# EAGLE design links_v40 (EAGLE 7.7.0)
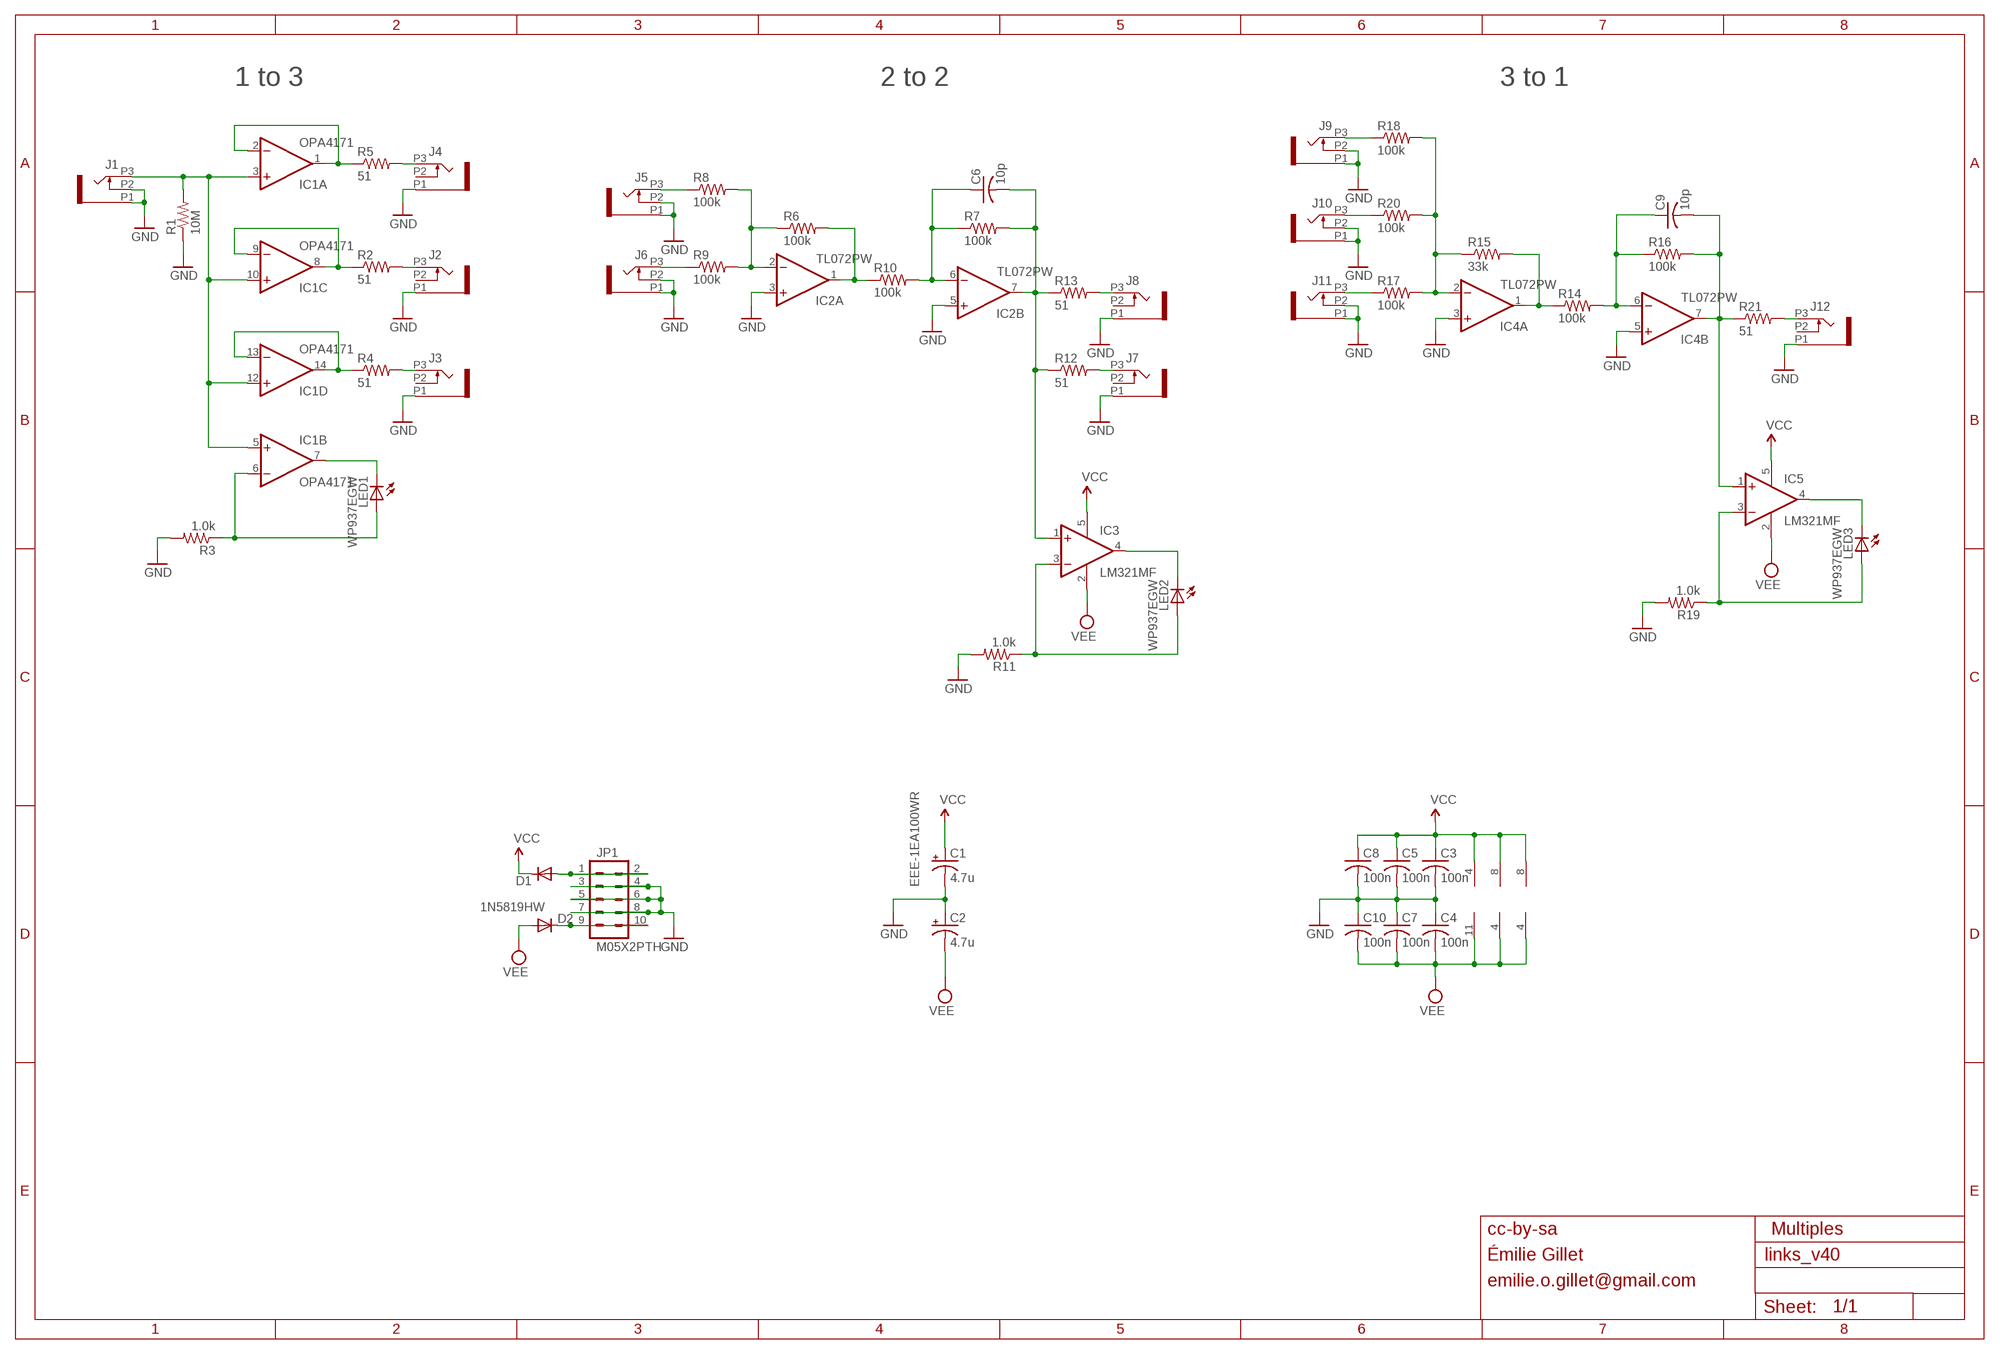
[diagram p0: schematic, sheet 1]

## Parts
C1  4.7u  CPOL-USA  [PANASONIC_A]
C2  4.7u  CPOL-USA  [PANASONIC_A]
C3  100n  C-USC0603  [C0603]
C4  100n  C-USC0603  [C0603]
C5  100n  C-USC0603  [C0603]
C6  10p  C-USC0603  [C0603]
C7  100n  C-USC0603  [C0603]
C8  100n  C-USC0603  [C0603]
C9  10p  C-USC0603  [C0603]
C10  100n  C-USC0603  [C0603]
D1  1N5819HW  DIODE-SOD123  [SOD123]
D2  1N5819HW  DIODE-SOD123  [SOD123]
IC1  OPA4171  TL074PW  [TSSOP14]
IC2  TL072PW  [TSSOP8]
IC3  LM321MF  [SOT23-5]
IC4  TL072PW  [TSSOP8]
IC5  LM321MF  [SOT23-5]
J1  PJ301_THONKICONN6  [WQP_PJ_301M6]
J2  PJ301_THONKICONN6  [WQP_PJ_301M6]
J3  PJ301_THONKICONN6  [WQP_PJ_301M6]
J4  PJ301_THONKICONN6  [WQP_PJ_301M6]
J5  PJ301_THONKICONN6  [WQP_PJ_301M6]
J6  PJ301_THONKICONN6  [WQP_PJ_301M6]
J7  PJ301_THONKICONN6  [WQP_PJ_301M6]
J8  PJ301_THONKICONN6  [WQP_PJ_301M6]
J9  PJ301_THONKICONN6  [WQP_PJ_301M6]
J10  PJ301_THONKICONN6  [WQP_PJ_301M6]
J11  PJ301_THONKICONN6  [WQP_PJ_301M6]
J12  PJ301_THONKICONN6  [WQP_PJ_301M6]
JP1  M05X2PTH  [AVR_ICSP]
LED1  WP937EGW  LED3MM  [LED3MM]
LED2  WP937EGW  LED3MM  [LED3MM]
LED3  WP937EGW  LED3MM  [LED3MM]
R1  10M  R-US_R0603  [R0603]
R2  51  R-US_R0603  [R0603]
R3  1.0k  R-US_R0603  [R0603]
R4  51  R-US_R0603  [R0603]
R5  51  R-US_R0603  [R0603]
R6  100k  R-US_R0603  [R0603]
R7  100k  R-US_R0603  [R0603]
R8  100k  R-US_R0603  [R0603]
R9  100k  R-US_R0603  [R0603]
R10  100k  R-US_R0603  [R0603]
R11  1.0k  R-US_R0603  [R0603]
R12  51  R-US_R0603  [R0603]
R13  51  R-US_R0603  [R0603]
R14  100k  R-US_R0603  [R0603]
R15  33k  R-US_R0603  [R0603]
R16  100k  R-US_R0603  [R0603]
R17  100k  R-US_R0603  [R0603]
R18  100k  R-US_R0603  [R0603]
R19  1.0k  R-US_R0603  [R0603]
R20  100k  R-US_R0603  [R0603]
R21  51  R-US_R0603  [R0603]

## Nets
GND: C1.- C2.+ C3.2 C4.1 C5.2 C7.1 C8.2 C10.1 IC2.3(A:+IN) IC2.5(B:+IN) IC4.3(A:+IN) IC4.5(B:+IN) J1.P1 J1.P2 J2.P1 J3.P1 J4.P1 J5.P1 J5.P2 J6.P1 J6.P2 J7.P1 J8.P1 J9.P1 J9.P2 J10.P1 J10.P2 J11.P1 J11.P2 J12.P1 JP1.3 JP1.4 JP1.5 JP1.6 JP1.7 JP1.8 R1.1 R3.2 R11.2 R19.2
N$1: IC2.1(A:OUT) R6.2 R10.1
N$2: J11.P3 R17.1
N$3: IC1.1(A:OUT) IC1.2(A:-IN) R5.1
N$4: IC1.8(C:OUT) IC1.9(C:-IN) R2.1
N$5: IC1.13(D:-IN) IC1.14(D:OUT) R4.1
N$6: D1.A JP1.1 JP1.2
N$7: IC1.3(A:+IN) IC1.5(B:+IN) IC1.10(C:+IN) IC1.12(D:+IN) J1.P3 R1.2
N$8: IC1.7(B:OUT) LED1.K(C)
N$9: J10.P3 R20.1
N$10: J6.P3 R9.1
N$11: J4.P3 R5.2
N$12: J2.P3 R2.2
N$13: J3.P3 R4.2
N$14: IC3.4(OUT) LED2.K(C)
N$15: J5.P3 R8.1
N$16: J7.P3 R12.2
N$17: J8.P3 R13.2
N$18: C9.2 IC4.7(B:OUT) IC5.1(+IN) R16.2 R21.1
N$19: IC5.3(-IN) LED3.A R19.1
N$20: D2.C JP1.9 JP1.10
N$21: IC1.6(B:-IN) LED1.A R3.1
N$22: J9.P3 R18.1
N$23: J12.P3 R21.2
N$24: IC4.2(A:-IN) R15.1 R17.2 R18.2 R20.2
N$25: IC4.1(A:OUT) R14.1 R15.2
N$26: C6.2 IC2.7(B:OUT) IC3.1(+IN) R7.2 R12.1 R13.1
N$27: C9.1 IC4.6(B:-IN) R14.2 R16.1
N$29: IC3.3(-IN) LED2.A R11.1
N$30: IC5.4(OUT) LED3.K(C)
N$31: IC2.2(A:-IN) R6.1 R8.2 R9.2
N$32: C6.1 IC2.6(B:-IN) R7.1 R10.2
VCC: C1.+ C3.1 C5.1 C8.1 D1.C IC1.4(P:V+) IC2.8(P:V+) IC3.5(V+) IC4.8(P:V+) IC5.5(V+)
VEE: C2.- C4.2 C7.2 C10.2 D2.A IC1.11(P:V-) IC2.4(P:V-) IC3.2(V-) IC4.4(P:V-) IC5.2(V-)
Unconnected: J2.P2 J3.P2 J4.P2 J7.P2 J8.P2 J12.P2

## Notes on the sheet
- 1 to 3 | 2 to 2 | 3 to 1
- EEE-1EA100WR
- cc-by-sa | Multiples
- Émilie Gillet
- emilie.o.gillet@gmail.com

## Library data of the parts
C1 C2 = rcl:CPOL-US: POLARIZED CAPACITOR, American symbol
C3-C10 = rcl:C-US: CAPACITOR, American symbol
D1 D2 = diode:DIODE-: DIODE
IC1 = linear:TL074: OP AMP
IC2 IC4 = linear:TL072: OP AMP
IC3 IC5 = linear:LM321?*: Low Power Single Op Amp Source: http://cache.national.com/ds/LM/LM321.pdf
J1-J12 = og-pj301:PJ301_THONKICONN
JP1 = og-header:M05X2: Header 5x2 Standard 10-pin dual row 0.1" header. Commonly used with AVR-ISP. Use with Spark Fun Electronics SKU: PRT-00778
LED1-LED3 = led:LED: LED OSRAM: - CHIPLED LG R971, LG N971, LY N971, LG Q971, LY Q971, LO R971, LY R971 LH N974, LH R974 LS Q976, LO Q976, LY Q976 LO Q996 - Hyper CHIPLED LW Q18S LB Q993, LB Q99A, LB R99A - SideLED LS A670, LO A670, LY A670, LG A670, LP A670 LB A673, LV A673, LT A673, LW A673 LH A674 LY A675 LS A676, LA A676, LO A676, LY A676, LW A676 LS A679, LY A679, LG A679 - Hyper Micro SIDELED® LS Y876, LA Y876, LO Y876, LY Y876 LT Y87S - SmartLED LW L88C, LW L88S LB L89C, LB L89S, LG L890 LS L89K, LO L89K, LY L89K LS L896, LA L896, LO L896, LY L896 - TOPLED LS T670, LO T670, LY T670, LG T670, LP T670 LSG T670, LSP T670, LSY T670, LOP T670, LYG T670 LG T671, LOG T671, LSG T671 LB T673, LV T673, LT T673, LW T673 LH T674 LS T676, LA T676, LO T676, LY T676, LB T676, LH T676, LSB T676, LW T676 LB T67C, LV T67C, LT T67C, LS T67K, LO T67K, LY T67K, LW E67C LS E67B, LA E67B, LO E67B, LY E67B, LB E67C, LV E67C, LT E67C LW T67C LS T679, LY T679, LG T679 LS T770, LO T770, LY T770, LG T770, LP T770 LB T773, LV T773, LT T773, LW T773 LH T774 LS E675, LA E675, LY E675, LS T675 LS T776, LA T776, LO T776, LY T776, LB T776 LHGB T686 LT T68C, LB T68C - Hyper Mini TOPLED® LB M676 - Mini TOPLED Santana® LG M470 LS M47K, LO M47K, LY M47K Source: http://www.osram.convergy.de LUXEON: - LUMILED® LXK2-PW12-R00, LXK2-PW12-S00, LXK2-PW14-U00, LXK2-PW14-V00 LXK2-PM12-R00, LXK2-PM12-S00, LXK2-PM14-U00 LXK2-PE12-Q00, LXK2-PE12-R00, LXK2-PE12-S00, LXK2-PE14-T00, LXK2-PE14-U00 LXK2-PB12-K00, LXK2-PB12-L00, LXK2-PB12-M00, LXK2-PB14-N00, LXK2-PB14-P00, LXK2-PB14-Q00 LXK2-PR12-L00, LXK2-PR12-M00, LXK2-PR14-Q00, LXK2-PR14-R00 LXK2-PD12-Q00, LXK2-PD12-R00, LXK2-PD12-S00 LXK2-PH12-R00, LXK2-PH12-S00 LXK2-PL12-P00, LXK2-PL12-Q00, LXK2-PL12-R00 Source: www.luxeon.com KINGBRIGHT: KA-3528ASYC Source: www.kingbright.com
R1-R21 = rcl:R-US_: RESISTOR, American symbol

## Board
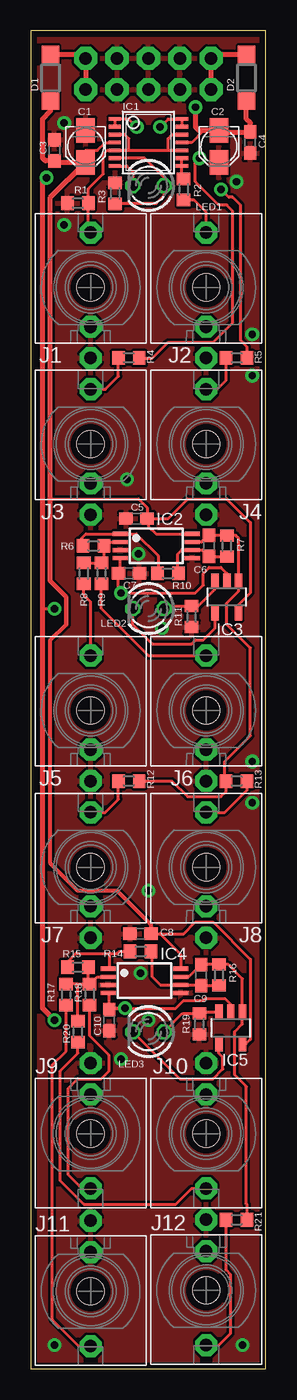
[diagram p1: board, top side]
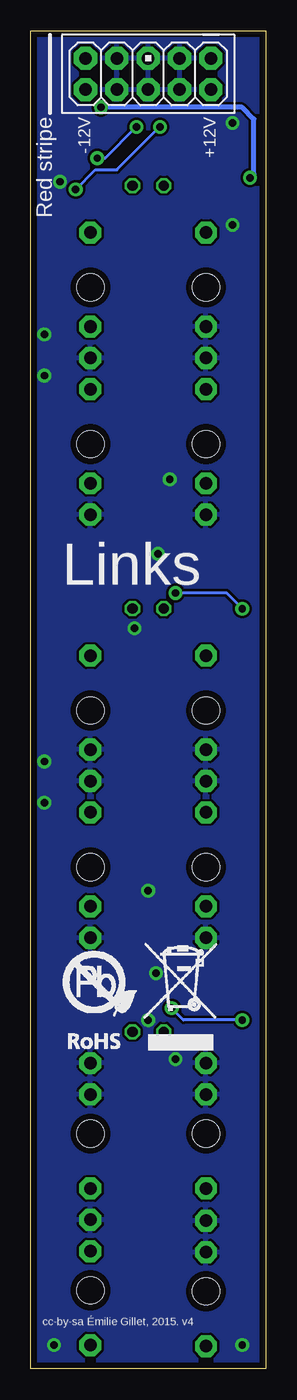
[diagram p2: board, bottom side, seen from below]

Size 19.03 x 108.43 mm. Coordinates in mm from the lower left corner, seen from the top.
Outline: 0,0 19.03,0 19.03,108.43 0,108.43 0,0
Copper layers (1*16): Top 0.035mm / dielectric 1.5mm / Bottom 0.035mm
Design rules "PCBCart-Standard *": minimum track width 8mil, minimum drill 0.4mm, track to track 8mil, track to pad 8mil, pad to pad 8mil, via to via 8mil, smd to smd 8mil, copper to edge 20mil, drill to drill 8mil, minimum pad ring 8mil, minimum via ring 10mil, stop-mask expansion 3mil, vias tented up to drill 25mil, thermal gap 8mil

### Footprints (pad centres in the part's own frame; a part is rotated, then mirrored left to right if it is on the bottom)
PANASONIC_A = smd 2 x 1.5: + 1.3,0; - -1.3,0
C0603 = smd 1.1 x 1: 1 -0.85,0; 2 0.85,0
SOD123 = smd 1.4 x 1.4: A 1.9,0; C -1.9,0
TSSOP14 = smd 0.305 x 0.991: 1 -1.905,-2.718; 2 -1.27,-2.718; 3 -0.635,-2.718; 4 0,-2.718; 5 0.635,-2.718; 6 1.27,-2.718; 7 1.905,-2.718; 8 1.905,2.718; 9 1.27,2.718; 10 0.635,2.718; 11 0,2.718; 12 -0.635,2.718; 13 -1.27,2.718; 14 -1.905,2.718
TSSOP8 = smd 0.35 x 1.2: 1 -0.975,-2.925; 2 -0.325,-2.925; 3 0.325,-2.925; 4 0.975,-2.925; 5 0.975,2.925; 6 0.325,2.925; 7 -0.325,2.925; 8 -0.975,2.925
SOT23-5 = smd 0.6 x 1.2: 1 -0.95,-1.306; 2 0,-1.306; 3 0.95,-1.306; 4 0.95,1.306; 5 -0.95,1.306
WQP_PJ_301M6 = drill 1.016 pad 1.778 octagon: P1 0,-5.715; P2 0,-3.175; P3 0,4.445 | hole 2.2: 0,0
AVR_ICSP = drill 1.016 pad 1.88 octagon: 1 -1.27,5.08; 2 1.27,5.08; 3 -1.27,2.54; 4 1.27,2.54; 5 -1.27,0; 6 1.27,0; 7 -1.27,-2.54; 8 1.27,-2.54; 9 -1.27,-5.08; 10 1.27,-5.08
LED3MM = drill 0.813 octagon: A -1.27,0; K 1.27,0
R0603 = smd 1 x 1.1: 1 -0.85,0; 2 0.85,0

### Placement (x,y rotation side)
C1  4.45,99.06 270 top
C2  15.24,99.06 270 top
C3  1.91,98.74 90 top
C4  17.78,99.38 90 top
C5  8.57,68.9 180 top
C6  14.45,66.67 90 top
C7  7.94,64.45 180 top
C8  8.89,35.24 180 top
C9  13.81,31.91 90 top
C10  6.35,28.26 90 top
D1  1.59,104.62 90 top
D2  17.46,104.62 270 top
IC1  9.53,99.38 270 top
IC2  10.16,66.67 270 top
IC3  15.88,62.55 180 top
IC4  9.21,31.43 270 top
IC5  16.19,27.62 180 top
J1  4.84,87.63 0 top
J2  14.21,87.63 0 top
J3  4.84,74.93 0 top
J4  14.21,74.93 0 top
J5  4.84,53.34 0 top
J6  14.21,53.34 0 top
J7  4.84,40.64 0 top
J8  14.21,40.64 0 top
J9  4.84,19.05 180 top
J10  14.21,19.05 180 top
J11  4.84,6.27 180 top
J12  14.21,6.35 180 top
JP1  9.53,104.93 270 bottom
LED1  9.53,95.89 180 top
LED2  9.53,61.59 180 top
LED3  9.53,27.3 180 top
R1  3.81,94.46 0 top
R2  12.38,95.57 270 top
R3  6.83,95.25 90 top
R4  7.94,81.92 180 top
R5  16.67,81.92 180 top
R6  5.08,66.67 180 top
R7  15.88,66.67 90 top
R8  4.29,64.45 90 top
R9  5.71,64.45 90 top
R10  11.11,64.45 0 top
R11  13.02,60.96 270 top
R12  7.94,47.62 180 top
R13  16.67,47.62 0 top
R14  8.89,33.81 0 top
R15  3.81,32.54 180 top
R16  15.24,31.91 90 top
R17  2.86,30.32 90 top
R18  4.76,30.32 90 top
R19  13.65,27.94 270 top
R20  3.81,27.3 90 top
R21  16.67,12.06 180 top
U$2  [ROHS]  17.3,25.24 0 bottom

### Tracks (layer width: path | path; a pad name or v marks a point on that pad's centre or on a via)
GND  (via drill 0.6)
  other vias: 8.73,66.04 7.78,72.07 8.89,32.07 7.3,25.08 9.53,28.26 9.53,38.73 2.7,92.71 10.64,60.01 1.91,1.91 17.14,1.91 2.7,100.97 16.67,96.2 17.94,80.49 17.94,83.82 17.94,45.88 17.94,49.21
  pour Bottom: 0,108.43 0,0 19.05,0 19.05,108.43
  pour Top: 0,108.43 0,0 19.05,0 19.05,108.43
N$1
  Top 0.254: R10.1 10.32,64.51 10.32,65.88 8.55,67.65 7.94,67.65 IC2.1 4.47,67.65 4.13,67.31 4.13,67.21 4.45,66.89 R6.2
N$2
  Top 0.254: R17.1 2.86,25.72 1.75,24.61 1.75,3.97 3.89,1.83 J11.P3
N$3  (via drill 0.6)
  Top 0.254: IC1.2 IC1.1 7.94,101.28 v8.57,100.65 | v15.4,95.57 16.03,94.93 16.35,94.93 16.99,94.3 16.99,83.34 17.52,82.81 R5.1
  Bottom 0.254: v15.4,95.57 13.81,97.16 12.06,97.16 v8.57,100.65
N$4
  Top 0.254: IC1.9 IC1.8 12.24,96.56 R2.1
N$5  (via drill 0.6)
  Top 0.254: IC1.13 IC1.14 11.11,101.28 v10.48,100.65 | v13.65,98.11 13.34,97.79 13.34,96.2 15.24,94.3 15.88,94.3 16.35,93.82 16.35,84.77 14.76,83.19 11.11,83.19 9.84,81.92 R4.1
  Bottom 0.254: v13.65,98.11 13.02,98.11 v10.48,100.65
N$6
  Top 0.406: JP1.2 JP1.1 4.13,106.52 D1.A
N$7
  Top 0.254: 7.94,98.74 IC1.5 6.19,98.74 5.87,98.42 5.87,96.84 4.66,95.62 R1.2 4.66,92.26 J1.P3 | 7.94,98.74 11.11,98.74 | 11.11,98.74 IC1.10 | IC1.3 7.62,100.01 7.94,99.69 7.94,98.74 | IC1.12 11.43,100.01 11.11,99.69 11.11,98.74
N$8
  Top 0.254: LED1.K 8.26,97 7.78,97.47 IC1.7
N$9
  Top 0.254: R20.1 3.81,25.56 2.38,24.13 2.38,15.24 4.29,13.34 11.75,13.34 13.02,14.61 J10.P3
N$10
  Top 0.254: J6.P3 9.53,57.78 5.71,61.59 R9.1
N$11
  Top 0.254: J4.P3 15.08,79.38 15.82,80.11 R5.2
N$12
  Top 0.254: R2.2 13.23,94.72 14.21,93.74 J2.P3
N$13
  Top 0.254: J3.P3 6.03,79.38 7.09,80.43 R4.2
N$14
  Top 0.254: LED2.K 8.26,60.33 9.84,58.74 13.02,58.74 13.34,59.05 13.97,59.05 14.93,60.01 IC3.4
N$15
  Top 0.254: R8.1 4.29,62.71 4.84,62.15 J5.P3
N$16
  Top 0.254: J7.P3 6.03,45.09 7.09,46.14 R12.2
N$17
  Top 0.254: J8.P3 15.72,45.09 17.52,46.89 R13.2
N$18
  Top 0.254: IC4.7 12.81,31.76 C9.2 R16.2 15.98,32.76 17.14,31.59 IC5.1 17.14,27.94 16.51,27.3 16.51,23.81 17.46,22.86 17.46,13.34 17.52,13.28 R21.1
N$19
  Top 0.254: LED3.A 12.28,28.79 R19.1 13.79,28.93 IC5.3 15.06,29.11
N$20
  Top 0.406: JP1.10 JP1.9 14.92,106.52 D2.C
N$21
  Top 0.254: IC1.6 9.21,98.11 10.79,96.52 LED1.A 10.79,95.09 10.16,94.46 6.88,94.46 R3.1
N$22
  Top 0.254: J9.P3 4.13,14.61 3.02,15.72 3.02,22.7 3.81,23.5 5.71,23.5 6.35,24.13 6.35,25.4 4.76,26.99 R18.1
N$23
  Top 0.254: J12.P3 15.24,1.91 16.19,2.86 16.19,7.62 15.82,7.99 R21.2
N$24
  Top 0.254: R20.2 3.81,31.17 | R18.2 5.03,31.44 | 3.81,31.17 | 3.81,31.17 R17.2 | 3.81,31.17 R18.2 | R18.2 4.66,31.27 R15.1 | IC4.2 5.4,31.75 4.82,31.17 R18.2
N$25
  Top 0.254: R15.2 3.02,32.6 3.02,33.02 3.65,33.66 6.35,33.66 | 6.35,33.66 6.99,33.66 7.14,33.81 R14.1 | IC4.1 6.35,32.48 6.35,33.66
N$26
  Top 0.254: IC2.7 13.81,67 13.81,66.99 14.34,67.53 C6.2 R7.2 16.61,67.53 16.82,67.31 IC3.1 16.86,63.82 16.83,63.78 16.83,63.02 15.88,62.07 15.88,60.33 17.78,58.42 17.78,51.28 15.72,49.21 15.72,47.73 R13.1 15.82,46.77 15.4,46.35 12.7,46.35 11.43,47.62 R12.1
N$27
  Top 0.254: R14.2 9.84,33.71 9.84,31.75 10.48,31.11 IC4.6 13.76,31.11 C9.1 R16.1
N$29
  Top 0.254: IC3.3 14.93,63.19 13.55,61.81 R11.1 11.01,61.81 LED2.A
N$30
  Top 0.254: 15.21,26.35 IC5.4 15.24,25.56 15.56,25.24 15.56,24.29 14.76,23.5 12.06,23.5 LED3.K
N$31
  Top 0.254: R8.2 R9.2 5.93,65.52 R6.1 | R6.1 5.94,66.68 | R6.1 6.25,67 IC2.2
N$32
  Top 0.254: R7.1 C6.1 13.92,66.35 IC2.6 12.22,66.35 11.91,66.04 11.91,64.51 R10.2
VCC
  Top 0.254: IC2.8 13.06,67.63 10.16,67.63 9.53,68.26 9.53,68.8 C5.1 | 9.63,35.24 C8.1 10.48,35.24 | IC4.8 12.13,33.59 10.48,35.24 | 1.59,70.48 8.73,70.48 9.42,69.79 C5.1 | 10.48,35.24 12.38,35.24 13.34,36.2 14.76,36.2 17.78,33.18 17.78,26.67 17.43,26.32 IC5.5 | IC3.5 16.83,61.91 17.78,62.87 17.78,68.58 15.88,70.48 12.7,70.48 11.11,68.9 C5.1 | IC1.4 6.03,99.38 5.4,98.74 4.45,98.74 C1.+
  Top 0.305: 1.59,59.05 1.59,40.96 3.81,38.73 6.99,38.73 9.74,35.98 C8.1
  Top 0.33: 1.59,59.05 2.86,60.33
  Top 0.356: 2.86,60.33 2.86,62.55
  Top 0.381: 2.86,62.55 1.59,63.82
  Top 0.406: 1.59,63.82 1.59,70.48 1.59,94.93 4.42,97.76 C1.+ 2.04,97.76 C3.1 1.17,97.89 0.95,98.11 0.95,101.28 1.59,101.92 D1.C
VEE  (via drill 0.6)
  Top 0.254: C7.2 7.24,64.6 IC2.4 | C7.2 6.77,64.14 | C7.2 7.09,63.08 v7.3,62.87 13.34,62.87 13.97,63.5 13.97,64.45 14.45,64.93 15.4,64.93 15.88,64.45 IC3.2 | IC4.4 6.35,30.39 C10.2 | C10.2 6.25,29.21 v7.62,29.21 | C10.2 6.45,29.21 11.75,29.21 12.38,29.84 13.97,29.84 14.13,30 15.72,30 16.19,29.53 IC5.2 | 0.95,61.59 v1.91,61.59 | IC1.11 13.02,99.38 14,100.36 C2.-
  Top 0.406: v1.91,28.26 0.95,29.21 0.95,61.59 0.95,96.2 v1.27,96.52 | 16.98,102.23 D2.A 17.46,101.28 17.78,100.97 C4.2 15.37,100.23 C2.- 13.62,100.36 13.34,100.65 v13.34,102.23
  Bottom 0.254: v7.3,62.87 3.17,62.87 v1.91,61.59 | v1.91,28.26 6.67,28.26 v7.62,29.21
  Bottom 0.406: v13.34,102.23 1.91,102.23 0.95,101.28 0.95,96.84 v1.27,96.52

### Text on the board
bPlace: Red stripe
bNames: +12V | -12V | Links | cc-by-sa Émilie Gillet, 2015. v4